# EAGLE design POE_V2 (EAGLE 9.6.2)
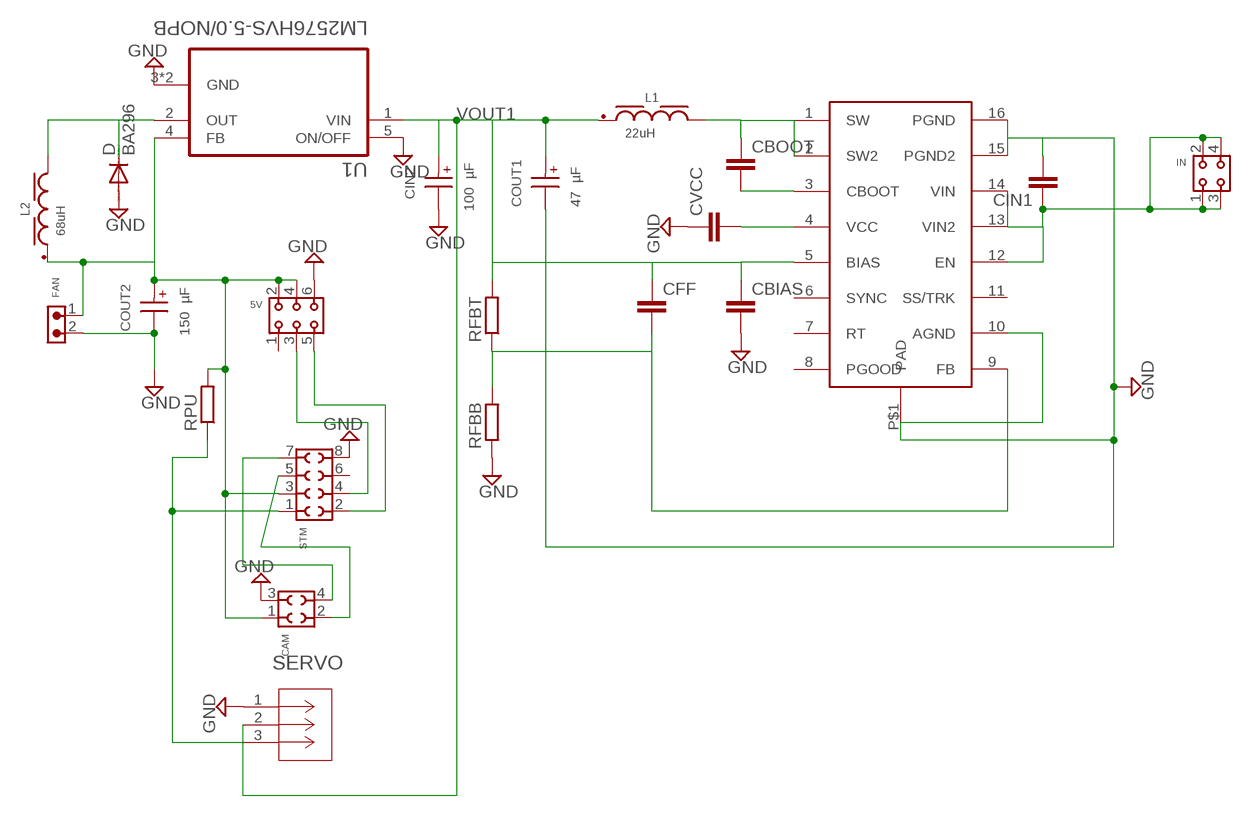
[diagram p0: schematic, sheet 1]

## Parts
5V  6130XX21821_61300621821  [61300621821]
CAM  6100XX21821_61000421821  [61000421821]
CBIAS  C-EUC1206  [C1206]
CBOOT  C-EUC1206  [C1206]
CFF  C-EUC1206  [C1206]
CIN1  C-EUC2220K  [C2220K]
CIN2  100 µF  WCAP-ASLI_6.3X5.5_865080343009  [WCAP-ASLI_6.3X5.5(DXL)]
COUT1  47 µF  WCAP-ASLI_5X5.5_865080342006  [WCAP-ASLI_5X5.5(DXL)]
COUT2  150 µF  WCAP-ASLI_6.3X5.5_865080143008  [WCAP-ASLI_6.3X5.5(DXL)]
CVCC  C-EUC1206  [C1206]
D  BA296  [P2-15]
FAN  6130XX11021_61300211021  [61300211021]
IN  6130XX21821_61300421821  [61300421821]
L1  22uH  WE-PD_1260_744771122  [WE-PD_1260]
L2  68uH  WE-PD_1210_7447709680  [WE-PD_1210]
RFBB  R-EU_M1206  [M1206]
RFBT  R-EU_M1206  [M1206]
RPU  R-EU_M1206  [M1206]
SERVO  22035035  [CON_22035035]
STM  6100XX21821_61000821821  [61000821821]
U1  LM2576HVS-5.0/NOPB  [VREG_TPS79625KTTR]
U$1  LM46002  [TSSOP16]

## Nets
GND: 5V.6 CAM.3 CBIAS.2 CIN1.2 CIN2.2(-) COUT1.2(-) COUT2.2(-) CVCC.1 D.A FAN.2 RFBB.1 SERVO.1 STM.8 U1.3(GND) U1.5(ON/OFF) U1.6(GND) U$1.10(AGND) U$1.15(PGND2) U$1.16(PGND) U$1.P$1(PAD)
N$1: CBOOT.1 L1.2 U$1.1(SW) U$1.2(SW2)
N$2: CBOOT.2 U$1.3(CBOOT)
N$3: CVCC.2 U$1.4(VCC)
N$4: 5V.3 STM.4
N$5: 5V.5 STM.2
N$6: D.C L2.2 U1.2(OUT)
N$7: CAM.4 STM.7
N$8: CAM.2 STM.5
N$9: RPU.1 SERVO.3 STM.1
RFBT: CFF.2 RFBB.2 RFBT.1 U$1.9(FB)
VIN: CIN1.1 IN.1 IN.2 IN.3 IN.4 U$1.12(EN) U$1.13(VIN2) U$1.14(VIN)
VOUT1: CBIAS.1 CFF.1 CIN2.1(+) COUT1.1(+) L1.1 RFBT.2 SERVO.2 U1.1(VIN) U$1.5(BIAS)
VOUT2: 5V.2 5V.4 CAM.1 COUT2.1(+) FAN.1 L2.1 RPU.2 STM.3 U1.4(FB)
Unconnected: 5V.1 STM.6 U$1.6(SYNC) U$1.7(RT) U$1.8(PGOOD) U$1.11(SS/TRK)

## Library data of the parts
5V = Eagle_WR-PHD (rev19a):6130XX21821_61300621821: WR-PHD 2.54 mm Dual Socket Header ARTICLE PROPERTIES: Pins:4;​ 6;​ 8;​ 10;​ 12;​ 14;​ 16;​ 18;​ 20;​ 22;​ 24;​ 26;​ 28;​ 30;​ 32;​ 34;​ 36;​ 40;​ 44;​ 64;​ 72 KIND PROPERTIES: Pitch：2.54 mm Quality Class:3 as per CECC 75 301-802 Rows：Dual Gender：Socket Header Type：Straight MATERIAL PROPERTIES: Insulator Material :PBT Insulator Flammability Rating:UL94 V-0 Contact Material:Copper Alloy Contact Plating:Gold Contact Type:Stamped GENERAL INFORMATION Operating Temperature:-40 up to +125 °C Compliance:Lead free / RoHS ELECTRICAL PROPERTIES: Rated Current:3 A IR 1:3 A Withstanding Voltage:500 V (AC) Contact Resistance:20 mΩ RISO:1000 MΩ CERTIFICATION UL Approval:E323964 PACKAGING PROPERTIES Packaging:Tray <https://katalog.we-online.com/media/images/v2/o57948v209%20Family_Dual_Socket_Header_WR-PHD_6130xx21821.jpg> Details see: https://katalog.we-online.com/en/em/PHD_2_54_DUAL_SOCKET_HEADER_6130XX21821 Updated by Yingchun,Shan 2019-10-21 2019 (C) Würth Elektronik; DATASHEET-URL: https://katalog.we-online.com/em/datasheet/61300621821.pdf; GENDER: Socket Header; IR: 3A; MATES: WR-PHD 2.54mm SMT Dual Pin Header/THT Angled Dual Pin Header/THT Dual Board Stacker/THT Dual Pin Header; PACKAGING: Tray; PART-NUMBER: 61300621821; PINS: 6; ROWS: Dual; TYPE: Straight
CAM = Eagle_WR-PHD (rev19a):6100XX21821_61000421821: WR-PHD 2.54mm SMT Socket Header ARTICLE PROPERTIES Pins: 4;​ 6;​ 8;​ 10;​ 12;​ 14;​ 16;​ 18;​ 20;​ 22;​ 24;​ 26;​ 28;​ 30;​ 32;​ 34;​ 36;​ 40 KIND PROPERTIES Pitch 2.54 mm Quality Class 3 as per CECC 75 301-802 Rows Dual Gender Socket Header Type Straight MATERIAL PROPERTIES Insulator Material PA9T Insulator Flammability Rating UL94 V-0 Contact Material Copper Alloy Contact Plating Gold Contact Type Stamped GENERAL INFORMATION Operating Temperature -40 up to +105 °C Compliance Lead free / RoHS ELECTRICAL PROPERTIES Rated Current 3 A;​ max. IR 1 3 A Withstanding Voltage 600 V (AC) Contact Resistance 20 mΩ RISO 1000 MΩ PACKAGING PROPERTIES Packaging Tube <https://katalog.we-online.com/media/images/v2/o33206v209%20Family_WR-PHD_610xxx21821.jpg> Details see: http://katalog.we-online.de/en/em/PHD_2_54_SMT_DUAL_SOCKET_HEADER_6100XX21821 Updated by Ella Wu 2019-06-12 2019 (C) Würth Elektronik; DATASHEET-URL: https://katalog.we-online.com/em/datasheet/61000421821.pdf; GENDER: Socket Header; IR: 3A; MATES: WR-PHD 2.54mm SMT Dual Pin Header/THT Angled Dual Pin Header/THT Dual Board Stacker/THT Dual Pin Header; PACKAGING: Tube; PART-NUMBER: 61000421821; PINS: 4; ROWS: Dual; TYPE: Straight; WE-NUMBER: 61000421821
CBIAS CBOOT CFF CVCC = rcl:C-EU: CAPACITOR, European symbol
CIN1 = rcl:C-EU: CAPACITOR, European symbol; SPICEPREFIX: C
CIN2 = Eagle_WCAP-ASLI (rev20a):WCAP-ASLI_6.3X5.5: WCAP-ASLI Aluminium Electrolytic Capacitors Low Impedance +105 °C Characteristics Low impedance product series Mounting style: V-Chip SMT Capacitance range: 0.1 µF ‒ 6800 µF Capacitance tolerance: ±20 % Voltage range (UR): 6.3 ‒ 100 V(DC) Operating temperature: -55 °C up to +105 °C Endurance: 2000 h @ +105 °C Dimensions (DxL) in mm: 4.0 x 5.5 up to 16.0 x 17.0 Recommended soldering: Reflow soldering Applications Low impedance, especially for filtering applications Input and output capacitor for switched-mode power supply Filtering Smoothing e.g. DC/DC converter, AC/DC converter, satellite receiver, control panel <https://www.we-online.com/catalog/media/o14723v209%20Family_WCAP-ASLI.jpg> Details see: https://www.we-online.com/catalog/en/WCAP-ASLI/ Updated by yingchun,Shan;2020-03-03 2020(C) Würth Elektronik; DATASHEET-URL: https://www.we-online.com/catalog/datasheet/865080343009.pdf; DF: 16%; DIAMETER: 6.3mm; I-LEAK: 16uA; I-RIPPLE: 255mA; L: 5.5mm; OPERATING-TEMPERATURE: -55 °C up to +105 °C; PART-NUMBER: 865080343009; TECHNICAL-REFERENCE: ASED055101M016DVCTBB000; VR: 16V(DC)
COUT1 = Eagle_WCAP-ASLI (rev20a):WCAP-ASLI_5X5.5: WCAP-ASLI Aluminium Electrolytic Capacitors Low Impedance +105 °C Characteristics Low impedance product series Mounting style: V-Chip SMT Capacitance range: 0.1 µF ‒ 6800 µF Capacitance tolerance: ±20 % Voltage range (UR): 6.3 ‒ 100 V(DC) Operating temperature: -55 °C up to +105 °C Endurance: 2000 h @ +105 °C Dimensions (DxL) in mm: 4.0 x 5.5 up to 16.0 x 17.0 Recommended soldering: Reflow soldering Applications Low impedance, especially for filtering applications Input and output capacitor for switched-mode power supply Filtering Smoothing e.g. DC/DC converter, AC/DC converter, satellite receiver, control panel <https://www.we-online.com/catalog/media/o14723v209%20Family_WCAP-ASLI.jpg> Details see: https://www.we-online.com/catalog/en/WCAP-ASLI/ Updated by yingchun,Shan;2020-03-03 2020(C) Würth Elektronik; DATASHEET-URL: https://www.we-online.com/catalog/datasheet/865080342006.pdf; DF: 16%; DIAMETER: 5mm; I-LEAK: 7.52uA; I-RIPPLE: 195mA; L: 5.5mm; OPERATING-TEMPERATURE: -55 °C up to +105 °C; PART-NUMBER: 865080342006; TECHNICAL-REFERENCE: ASEC055470M016DVCTBB000; VR: 16V(DC)
COUT2 = Eagle_WCAP-ASLI (rev20a):WCAP-ASLI_6.3X5.5: WCAP-ASLI Aluminium Electrolytic Capacitors Low Impedance +105 °C Characteristics Low impedance product series Mounting style: V-Chip SMT Capacitance range: 0.1 µF ‒ 6800 µF Capacitance tolerance: ±20 % Voltage range (UR): 6.3 ‒ 100 V(DC) Operating temperature: -55 °C up to +105 °C Endurance: 2000 h @ +105 °C Dimensions (DxL) in mm: 4.0 x 5.5 up to 16.0 x 17.0 Recommended soldering: Reflow soldering Applications Low impedance, especially for filtering applications Input and output capacitor for switched-mode power supply Filtering Smoothing e.g. DC/DC converter, AC/DC converter, satellite receiver, control panel <https://www.we-online.com/catalog/media/o14723v209%20Family_WCAP-ASLI.jpg> Details see: https://www.we-online.com/catalog/en/WCAP-ASLI/ Updated by yingchun,Shan;2020-03-03 2020(C) Würth Elektronik; DATASHEET-URL: https://www.we-online.com/catalog/datasheet/865080143008.pdf; DF: 24%; DIAMETER: 6.3mm; I-LEAK: 9.45uA; I-RIPPLE: 235mA; L: 5.5mm; OPERATING-TEMPERATURE: -55 °C up to +105 °C; PART-NUMBER: 865080143008; TECHNICAL-REFERENCE: ASED055151M6R3DVCTBB000; VR: 6.3V(DC)
D = diode:BA296: DIODE
FAN = Eagle_WR-PHD (rev19a):6130XX11021_61300211021: WR-PHD 2.54 mm THT Angled Pin Header ARTICLE PROPERTIES: Pins:2;​ 3;​ 4;​ 5;​ 6;​ 7;​ 8;​ 9;​ 10;​ 12;​ 14;​ 16;​ 18;​ 22;​ 32;​ 34;​ 36;​ 40 KIND PROPERTIES: Pitch：2.54 mm Quality Class:3 as per CECC 75 301-802 Rows：Single Gender：Pin Header Type：Angled MATERIAL PROPERTIES: Insulator Material :PA6T Insulator Flammability Rating:UL94 V-0 Contact Material:Copper Alloy Contact Plating:Gold Contact Type:Stamped GENERAL INFORMATION Operating Temperature:-40 up to +105 °C Compliance:Lead free / RoHS ELECTRICAL PROPERTIES: Rated Current:3 A IR 1:3 A Withstanding Voltage:500 V (AC) Contact Resistance:20 mΩ RISO:1000 MΩ CERTIFICATION UL Approval:E323964 PACKAGING PROPERTIES Packaging:Bag <https://katalog.we-online.com/media/images/v2/o33210v209%20Family_WR-PHD_6130xx11021.jpg> Details see: https://katalog.we-online.com/en/em/PHD_2_54_THT_ANGLED_PIN_HEADER_6130XX11021 Updated by Yingchun,Shan 2019-10-16 2019 (C) Würth Elektronik; DATASHEET-URL: https://katalog.we-online.com/em/datasheet/61300211021.pdf; GENDER: Pin Header; IR: 3A; MATES: WR-PHD 2.5mm Angled Socket Header/SMT Socket Header/Socket Header/Soket Header Bottom Entry; PACKAGING: Bag; PART-NUMBER: 61300211021; PINS: 2; ROWS: Single; TYPE: Angled
IN = Eagle_WR-PHD (rev19a):6130XX21821_61300421821: WR-PHD 2.54 mm Dual Socket Header ARTICLE PROPERTIES: Pins:4;​ 6;​ 8;​ 10;​ 12;​ 14;​ 16;​ 18;​ 20;​ 22;​ 24;​ 26;​ 28;​ 30;​ 32;​ 34;​ 36;​ 40;​ 44;​ 64;​ 72 KIND PROPERTIES: Pitch：2.54 mm Quality Class:3 as per CECC 75 301-802 Rows：Dual Gender：Socket Header Type：Straight MATERIAL PROPERTIES: Insulator Material :PBT Insulator Flammability Rating:UL94 V-0 Contact Material:Copper Alloy Contact Plating:Gold Contact Type:Stamped GENERAL INFORMATION Operating Temperature:-40 up to +125 °C Compliance:Lead free / RoHS ELECTRICAL PROPERTIES: Rated Current:3 A IR 1:3 A Withstanding Voltage:500 V (AC) Contact Resistance:20 mΩ RISO:1000 MΩ CERTIFICATION UL Approval:E323964 PACKAGING PROPERTIES Packaging:Tray <https://katalog.we-online.com/media/images/v2/o57948v209%20Family_Dual_Socket_Header_WR-PHD_6130xx21821.jpg> Details see: https://katalog.we-online.com/en/em/PHD_2_54_DUAL_SOCKET_HEADER_6130XX21821 Updated by Yingchun,Shan 2019-10-21 2019 (C) Würth Elektronik; DATASHEET-URL: https://katalog.we-online.com/em/datasheet/61300421821.pdf; GENDER: Socket Header; IR: 3A; MATES: WR-PHD 2.54mm SMT Dual Pin Header/THT Angled Dual Pin Header/THT Dual Board Stacker/THT Dual Pin Header; PACKAGING: Tray; PART-NUMBER: 61300421821; PINS: 4; ROWS: Dual; TYPE: Straight
L1 = Eagle_WE-PD (rev20a):WE-PD_1260: WE-PD SMT Power Inductor Characteristics AECQ 200 Qualified Ultra low RDC and RAC Highest possible saturation current based on Ferrite Suitable for switching frequency up to 10MHz Temperature dependent parameter available on Redexpert Operating Temperature from -40°C to +125°C / +150°C Types WE-PD: Since always with low loss material, tight tolerances and high saturation behavior compared to other manufacturers in the market WE-PD Robust: Plastic base improves the mechanical stability and efficiency WE-PD Performance: MnZn core improves Saturation and RDC for highest efficiency Applications Switch Mode Power supplies from 0,1W up to 300W Integrated DC DC Converter Ideal for Switch Mode Power supplies with extreme high efficiency (>95%) <https://www.we-online.com/catalog/media/o14825v209%20Family_WE-PD.jpg> Details see: https://www.we-online.com/catalog/en/WE-PD/ Updated by Yingchun,Shan 2019-07-25 2019 (C) Wurth Elektronik; DATASHEET-URL: https://www.we-online.com/catalog/datasheet/744771122.pdf; FRES: 13.5MHz; IR: 3.37A; ISAT: 3.77A; MOUNT: SMT; PART-NUMBER: 744771122; RDC-MAX: 36mOhm; RDC-TYP: 31mOhm; VERSION: Standard
L2 = Eagle_WE-PD (rev20a):WE-PD_1210: WE-PD SMT Power Inductor Characteristics AECQ 200 Qualified Ultra low RDC and RAC Highest possible saturation current based on Ferrite Suitable for switching frequency up to 10MHz Temperature dependent parameter available on Redexpert Operating Temperature from -40°C to +125°C / +150°C Types WE-PD: Since always with low loss material, tight tolerances and high saturation behavior compared to other manufacturers in the market WE-PD Robust: Plastic base improves the mechanical stability and efficiency WE-PD Performance: MnZn core improves Saturation and RDC for highest efficiency Applications Switch Mode Power supplies from 0,1W up to 300W Integrated DC DC Converter Ideal for Switch Mode Power supplies with extreme high efficiency (>95%) <https://www.we-online.com/catalog/media/o14825v209%20Family_WE-PD.jpg> Details see: https://www.we-online.com/catalog/en/WE-PD/ Details see: https://katalog.we-online.com/en/pbs/WE-PD Updated by Yingchun,Shan 2019-07-25 2019 (C) Wurth Elektronik; DATASHEET-URL: https://www.we-online.com/catalog/datasheet/7447709680.pdf; FRES: 5.5MHz; IR: 3.2A; ISAT: 3.6A; MOUNT: SMT; PART-NUMBER: 7447709680; RDC-MAX: 89mOhm; RDC-TYP: 69mOhm; VERSION: Standard
RFBB RFBT RPU = resistor:R-EU_: RESISTOR, European symbol
SERVO = Port_Servo:22035035; BUILT_BY: Molex_Team; COPYRIGHT: Copyright (C) 2018 Accelerated Designs. All rights reserved; MANUFACTURER_PART_NUMBER: 22035035; SOURCELIBRARY: Add_to_database_2021-02-22; VENDOR: Molex Connector Corporation
STM = Eagle_WR-PHD (rev19a):6100XX21821_61000821821: WR-PHD 2.54mm SMT Socket Header ARTICLE PROPERTIES Pins: 4;​ 6;​ 8;​ 10;​ 12;​ 14;​ 16;​ 18;​ 20;​ 22;​ 24;​ 26;​ 28;​ 30;​ 32;​ 34;​ 36;​ 40 KIND PROPERTIES Pitch 2.54 mm Quality Class 3 as per CECC 75 301-802 Rows Dual Gender Socket Header Type Straight MATERIAL PROPERTIES Insulator Material PA9T Insulator Flammability Rating UL94 V-0 Contact Material Copper Alloy Contact Plating Gold Contact Type Stamped GENERAL INFORMATION Operating Temperature -40 up to +105 °C Compliance Lead free / RoHS ELECTRICAL PROPERTIES Rated Current 3 A;​ max. IR 1 3 A Withstanding Voltage 600 V (AC) Contact Resistance 20 mΩ RISO 1000 MΩ PACKAGING PROPERTIES Packaging Tube <https://katalog.we-online.com/media/images/v2/o33206v209%20Family_WR-PHD_610xxx21821.jpg> Details see: http://katalog.we-online.de/en/em/PHD_2_54_SMT_DUAL_SOCKET_HEADER_6100XX21821 Updated by Ella Wu 2019-06-12 2019 (C) Würth Elektronik; DATASHEET-URL: https://katalog.we-online.com/em/datasheet/61000821821.pdf; GENDER: Socket Header; IR: 3A; MATES: WR-PHD 2.54mm SMT Dual Pin Header/THT Angled Dual Pin Header/THT Dual Board Stacker/THT Dual Pin Header; PACKAGING: Tube; PART-NUMBER: 61000821821; PINS: 8; ROWS: Dual; TYPE: Straight; WE-NUMBER: 61000821821
U1 = LM2576HVS-5.0_NOPB:LM2576HVS-5.0/NOPB; DESCRIPTION: SIMPLE SWITCHER&reg; 4V to 60V, 3A Low Component Count Step-Down Regulator 5-DDPAK/TO-263 -40 to 125; DIGI-KEY_PART_NUMBER: LM2576HVS-5.0/NOPB-ND; MF: Texas Instruments; MP: LM2576HVS-5.0/NOPB; PACKAGE: TO-263-5 Texas Instruments; PURCHASE-URL: https://pricing.snapeda.com/search/part/LM2576HVS-5.0/NOPB/?ref=eda
U$1 = analog-devices-3:LM46002

## Board
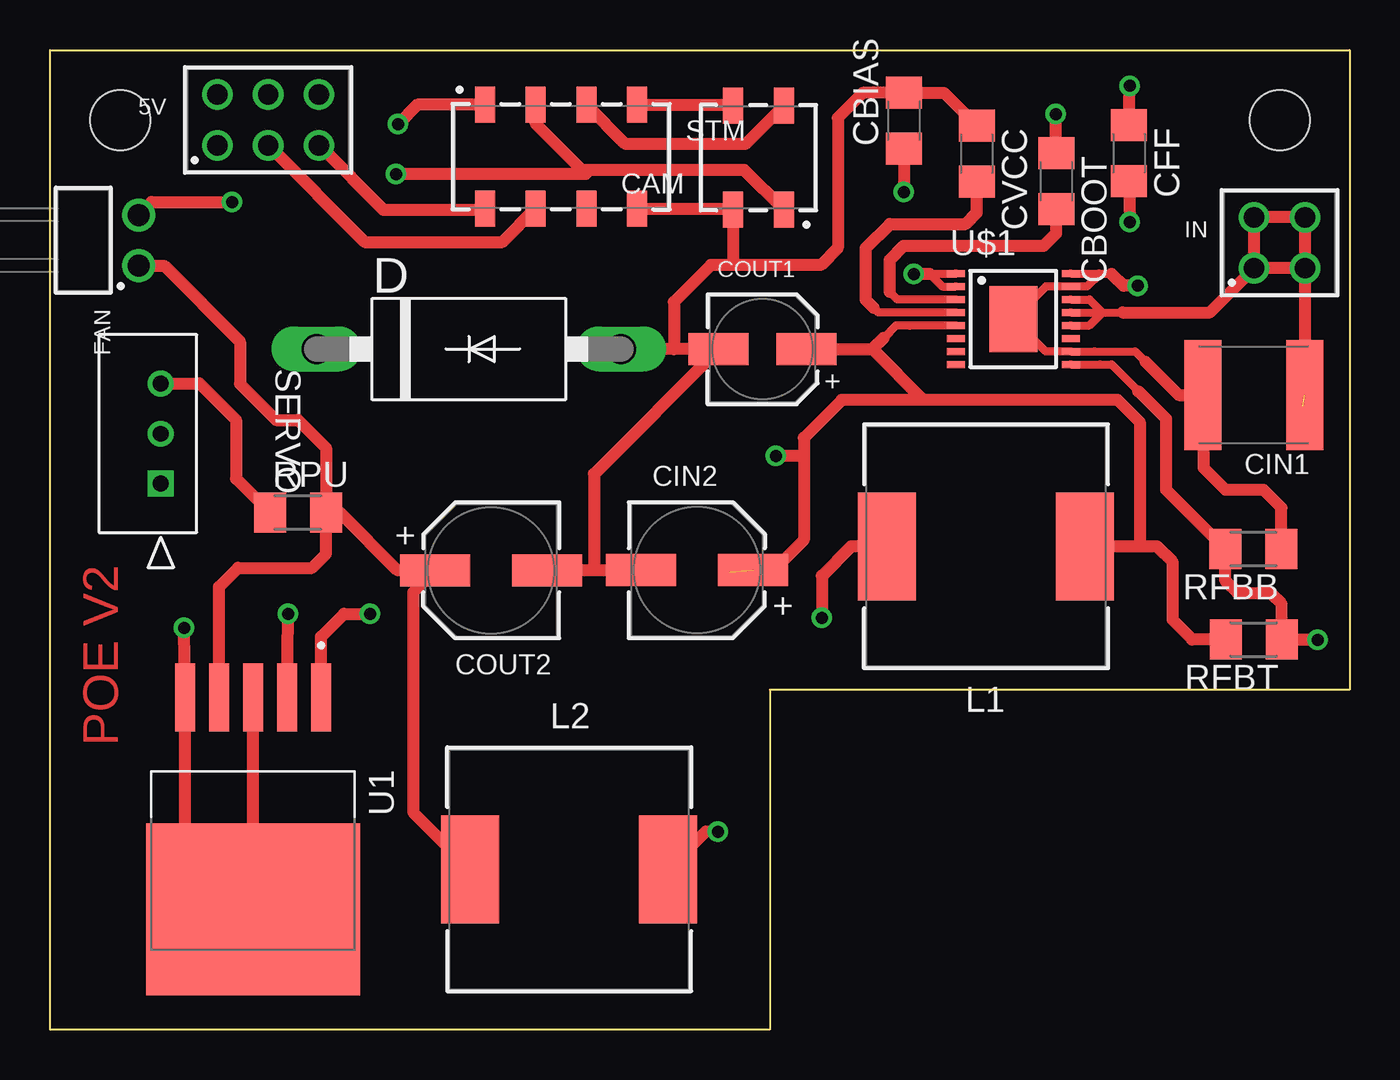
[diagram p1: board, top side]
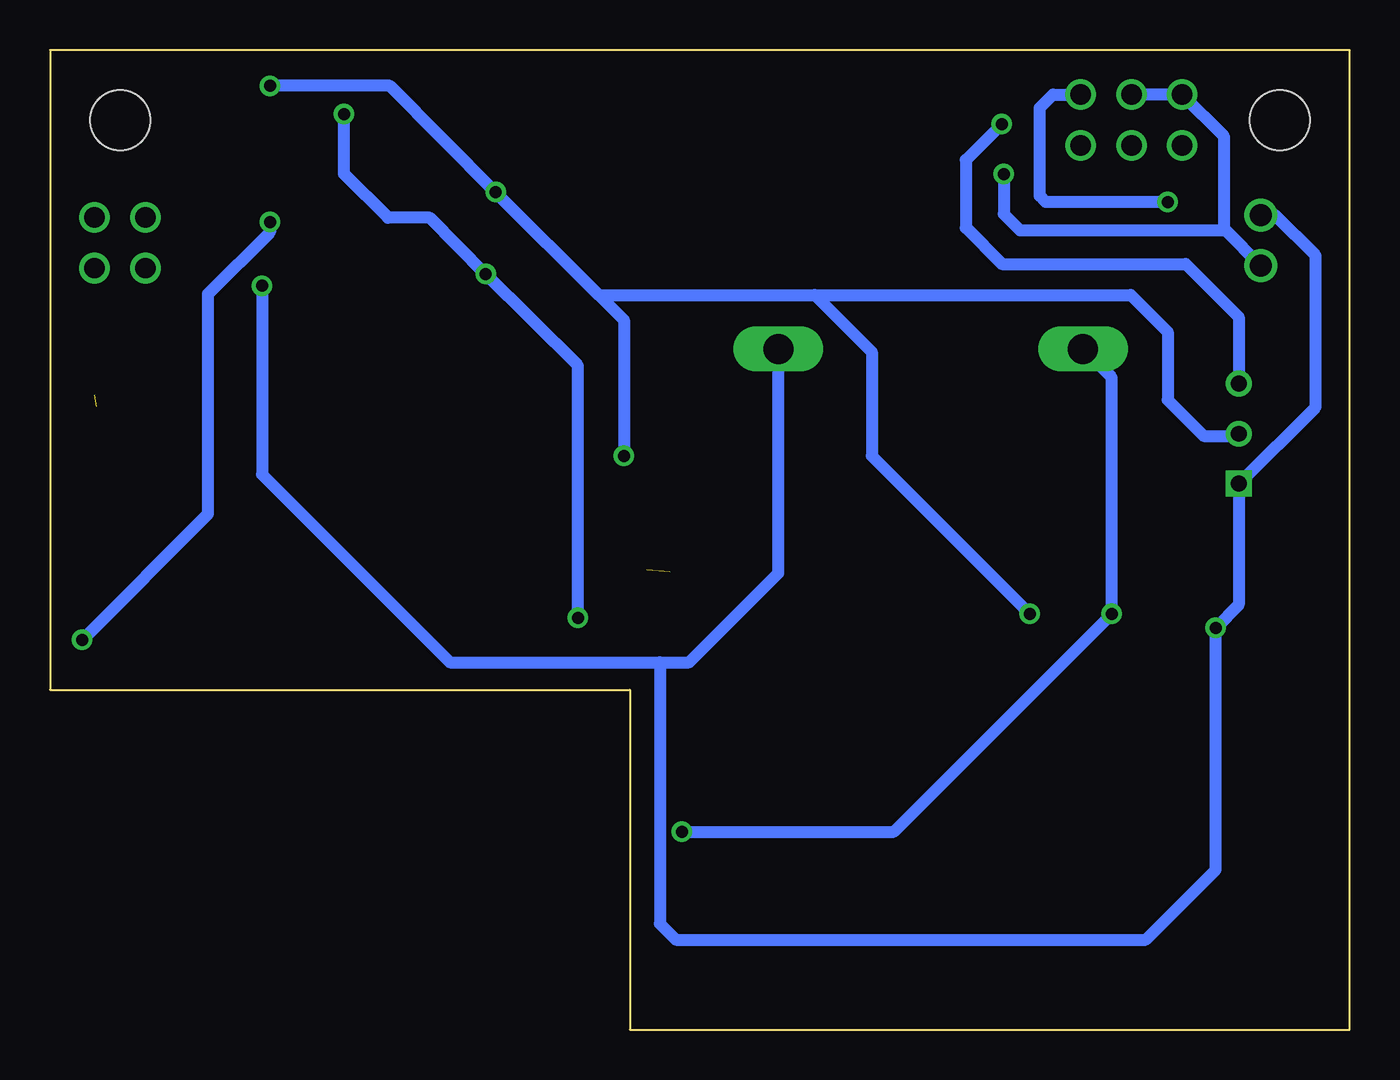
[diagram p2: board, bottom side, seen from below]

Size 65 x 49 mm. Coordinates in mm from the lower left corner, seen from the top.
Outline: 0,0 0,49 65,49 65,17 36,17 36,0 0,0
Copper layers (1*16): Top 0.035mm / dielectric 1.5mm / Bottom 0.035mm
Design rules "default": minimum track width 6mil, minimum drill 0.35mm, track to track 6mil, track to pad 6mil, pad to pad 6mil, via to via 6mil, smd to smd 6mil, copper to edge 40mil, drill to drill 6mil, minimum pad ring 10mil, minimum via ring 8mil, stop-mask expansion 4mil, vias tented up to drill 0mil, thermal gap 10mil
Holes 3 mm at 3.5,45.5 61.5,45.5

### Footprints (pad centres in the part's own frame; a part is rotated, then mirrored left to right if it is on the bottom)
61300621821 = drill 1.02: 1 -2.54,-1.27; 2 -2.54,1.27; 3 0,-1.27; 4 0,1.27; 5 2.54,-1.27; 6 2.54,1.27
61000421821 = smd 1 x 1.8: 1 -1.27,2.6; 2 -1.27,-2.6; 3 1.27,2.6; 4 1.27,-2.6
C1206 = smd 1.6 x 1.8: 1 -1.4,0; 2 1.4,0
C2220K = smd 1.85 x 5.5: 1 -2.55,0; 2 2.55,0
WCAP-ASLI_6.3X5.5(DXL) = smd 3.5 x 1.6: 1 2.8,0; 2 -2.8,0
WCAP-ASLI_5X5.5(DXL) = smd 3 x 1.6: 1 2.2,0; 2 -2.2,0
P2-15 = drill 1.499 long: A 7.62,0; C -7.62,0
61300211021 = drill 1.1: 1 1.27,2.77; 2 -1.27,2.77
61300421821 = drill 1.02: 1 -1.27,-1.27; 2 -1.27,1.27; 3 1.27,-1.27; 4 1.27,1.27
WE-PD_1260 = smd 2.9 x 5.4: 1 -4.95,0; 2 4.95,0
WE-PD_1210 = smd 2.9 x 5.4: 1 -4.95,0; 2 4.95,0
M1206 = smd 1.6 x 2: 1 -1.4,0; 2 1.4,0
CON_22035035 = drill 0.787 pad 1.143 square: 1 0,0 | drill 0.787 pad 1.143: 2 -2.489,0; 3 -5.004,0
61000821821 = smd 1 x 1.8: 1 -3.81,2.6; 2 -3.81,-2.6; 3 -1.27,2.6; 4 -1.27,-2.6; 5 1.27,2.6; 6 1.27,-2.6; 7 3.81,2.6; 8 3.81,-2.6
VREG_TPS79625KTTR = smd 3.4 x 1: 1 -10.6,3.4; 2 -10.6,1.7; 3 -10.6,0; 4 -10.6,-1.7; 5 -10.6,-3.4 | smd 8.6 x 10.7: 6 0,0
TSSOP16 = smd 0.9 x 0.35: 1 -2.875,2.275; 2 -2.875,1.625; 3 -2.875,0.975; 4 -2.875,0.325; 5 -2.875,-0.325; 6 -2.875,-0.975; 7 -2.875,-1.625; 8 -2.875,-2.275; 9 2.875,-2.275; 10 2.875,-1.625; 11 2.875,-0.975; 12 2.875,-0.325; 13 2.875,0.325; 14 2.875,0.975; 15 2.875,1.625; 16 2.875,2.275 | smd 2.41 x 3.29: P$1 0,0

### Placement (x,y rotation side)
5V  10.91,45.5 0 top
CAM  35.43,43.62 180 top
CBIAS  42.72,45.46 90 top
CBOOT  50.33,42.43 270 top
CFF  53.97,43.84 270 top
CIN1  60.21,31.74 180 top
CIN2  32.36,22.98 0 top
COUT1  35.64,34.03 0 top
COUT2  22.07,22.97 180 top
CVCC  46.35,43.81 270 top
D  20.95,34.04 0 top
FAN  1.66,39.48 270 top
IN  61.5,39.36 0 top
L1  46.82,24.17 180 top
L2  25.97,8.02 0 top
RFBB  60.19,24.04 180 top
RFBT  60.2,19.51 180 top
RPU  12.4,25.86 0 top
SERVO  5.54,27.31 270 top
STM  25.56,43.66 0 top
U1  10.15,6.01 270 top
U$1  48.18,35.54 0 top

### Tracks (layer width: path | path; a pad name or v marks a point on that pad's centre or on a via)
GND  (via drill 0.6)
  Top 0.4: 54.8,33.4 54.28,33.92 52.25,33.92 52.24,33.91 U$1.10 49.8,33.91 U$1.P$1 49.8,37.16 U$1.15 51.87,37.16 52.5,37.8 52.48,37.81 | U$1.16 52.48,37.81 | 52.48,37.81 53.09,37.81 53.1,37.8
  Top 0.6: RFBB.1 61.59,26.11 60.7,27 58.8,27 57.7,28.1 57.7,31.7 CIN1.2 56.46,31.74 54.8,33.4 | CVCC.1 44.7,46.86 CBIAS.2 40.66,46.86 39.4,45.6 39.4,39.1 38.55,38.25 34.1,38.25 | CIN2.2 27.2,22.97 | 27.2,22.97 COUT2.2 | 27.2,22.97 27.2,27.79 COUT1.2 31.2,34.03 | 31.2,34.03 D.A | 31.2,34.03 31.2,36.4 33.05,38.25 34.1,38.25 | 53.1,37.8 53.7,37.2 v54.4,37.2 | U1.3 U1.6 6.75,9.41 U1.5 v6.7,20.1 | STM.8 34.12,41.06 CAM.3 34.16,38.31 34.1,38.25 | FAN.2 5.08,41.4 v9.1,41.4
  Bottom 0.6: v54.4,37.2 54.4,27.77 45,18.37 34.5,18.37 | 34.5,18.37 33.03,18.37 28.57,22.83 D.A | 34.5,18.37 34.5,5.3 33.7,4.5 10.2,4.5 6.7,8 v6.7,20.1 5.54,21.26 SERVO.1 1.7,31.15 1.7,38.7 3.75,40.75 FAN.2 | v9.1,41.4 15.2,41.4 15.5,41.7 15.5,46.1 14.83,46.77 5V.6
N$1  (via drill 0.6)
  Top 0.4: U$1.1 44,37.8 44.63,37.16 U$1.2
  Top 0.6: 44,37.8 v43.2,37.8 | L1.2 40.07,24.17 38.6,22.7 v38.6,20.6 | CBOOT.1 50.3,45.4 v50.3,45.8
  Bottom 0.6: v50.3,45.8 50.3,42.8 48.1,40.6 46,40.6 v43.2,37.8 38.6,33.2 v38.6,20.6
N$2
  Top 0.4: U$1.3 42.38,36.52 42,36.9
  Top 0.6: 42,36.9 42,38.5 42.7,39.2 49.7,39.2 50.33,39.83 CBOOT.2
N$3
  Top 0.4: U$1.4 41.44,35.87 41.2,36.1
  Top 0.6: 41.2,36.1 40.8,36.5 40.8,39.1 42,40.3 45.8,40.3 46.35,40.85 CVCC.2
N$4
  Top 0.6: 5V.3 15.74,39.4 22.63,39.4 STM.4
N$5
  Top 0.6: 5V.5 16.68,41 21.69,41 STM.2
N$6  (via drill 0.6)
  Top 0.6: U1.2 v11.9,20.8 | v33.4,9.9 32.8,9.9 L2.2
  Bottom 0.6: D.C 11.9,32.61 v11.9,20.8 22.8,9.9 v33.4,9.9
N$7
  Top 0.6: STM.7 34.12,46.26 CAM.4
N$8
  Top 0.6: CAM.2 34.78,44.3 28.79,44.3 STM.5
N$9  (via drill 0.6)
  Top 0.6: RPU.1 9.3,27.56 9.3,30.5 7.49,32.31 SERVO.3 | STM.1 18.36,46.26 v17.4,45.3
  Bottom 0.6: v17.4,45.3 19.2,43.5 19.2,40.1 17.4,38.3 8.2,38.3 5.54,35.64 SERVO.3
RFBT  (via drill 0.6)
  Top 0.4: U$1.9 52.52,33.27 53.1,33.27 54.44,31.93
  Top 0.6: 54.44,31.93 55.83,30.54 55.83,27 RFBB.2 58.79,22.45 59.43,21.81 61.07,21.81 61.6,21.28 RFBT.1 v63.39,19.51 v63.4,19.5 | CFF.2 v54,40.4
  Bottom 0.6: v54,40.4 54,39.9 57.1,36.8 57.1,25.8 v63.4,19.5
VIN  (1 unrouted)
  Top 0.4: U$1.13 52.64,35.87 | U$1.14 51.99,36.52 52.64,35.87 | U$1.12 51.98,35.22 52.64,35.87 | 52.64,35.87 53.65,35.87
  Top 0.6: IN.3 62.77,31.26 62.67,31.16 | IN.1 IN.2 IN.4 IN.3 | IN.3 IN.1 | 53.65,35.87 58.01,35.87 IN.1
VOUT1  (via drill 0.6)  (1 unrouted)
  Top 0.4: U$1.5 43.02,35.22 | 43,35.2 43.02,35.22 | 43.02,35.22 42.31,35.22 41.7,34.6
  Top 0.6: RFBT.2 57.13,19.51 56.15,20.49 56.15,23.38 55.36,24.17 54.5,24.17 | 54.5,24.17 L1.1 | 41.7,34.6 41.13,34.03 | COUT1.1 41.13,34.03 | 41.13,34.03 43.66,31.5 | 54.5,24.17 54.5,30.4 53.4,31.5 43.66,31.5 | 43.66,31.5 39.6,31.5 37.7,29.6 37.7,28.7 | 37.7,28.7 37.7,24.5 36.1,22.9 34,22.9 | CBIAS.1 42.72,41.92 v42.7,41.9 | CFF.1 v54,47.2 | 37.7,28.7 v36.3,28.7 | U1.1 13.55,19.65 14.7,20.8 v16,20.8
  Bottom 0.6: v54,47.2 48,47.2 v42.7,41.9 37.55,36.75 | 37.55,36.75 36.3,35.5 v36.3,28.7 | 37.55,36.75 26.75,36.75 | 26.75,36.75 23.9,33.9 23.9,28.7 v16,20.8 | 26.75,36.75 10.95,36.75 9.1,34.9 9.1,31.5 7.3,29.7 5.64,29.7 SERVO.2
VOUT2  (via drill 0.6)
  Top 0.6: L2.1 18.17,10.87 18.17,21.87 COUT2.1 17.39,22.97 14.5,25.86 RPU.2 | U1.4 8.45,22.15 9.4,23.1 13.1,23.1 13.8,23.8 RPU.2 | FAN.1 5.7,38.2 9.5,34.4 9.5,32.3 11.3,30.5 12.4,30.5 13.8,29.1 RPU.2 | CAM.1 34.72,43 26.61,43 | 26.61,43 24.29,45.32 STM.3 | 26.61,43 26.81,42.8 v17.3,42.8
  Bottom 0.6: FAN.1 6.2,39.98 6.3,39.98 | 5V.4 5V.2 6.3,44.7 6.3,39.98 | v17.3,42.8 17.3,40.8 16.48,39.98 6.3,39.98

### Text on the board
Top: POE V2